# EAGLE schematic untitled (EAGLE 6.4)

## Sheet 1 of 5: main
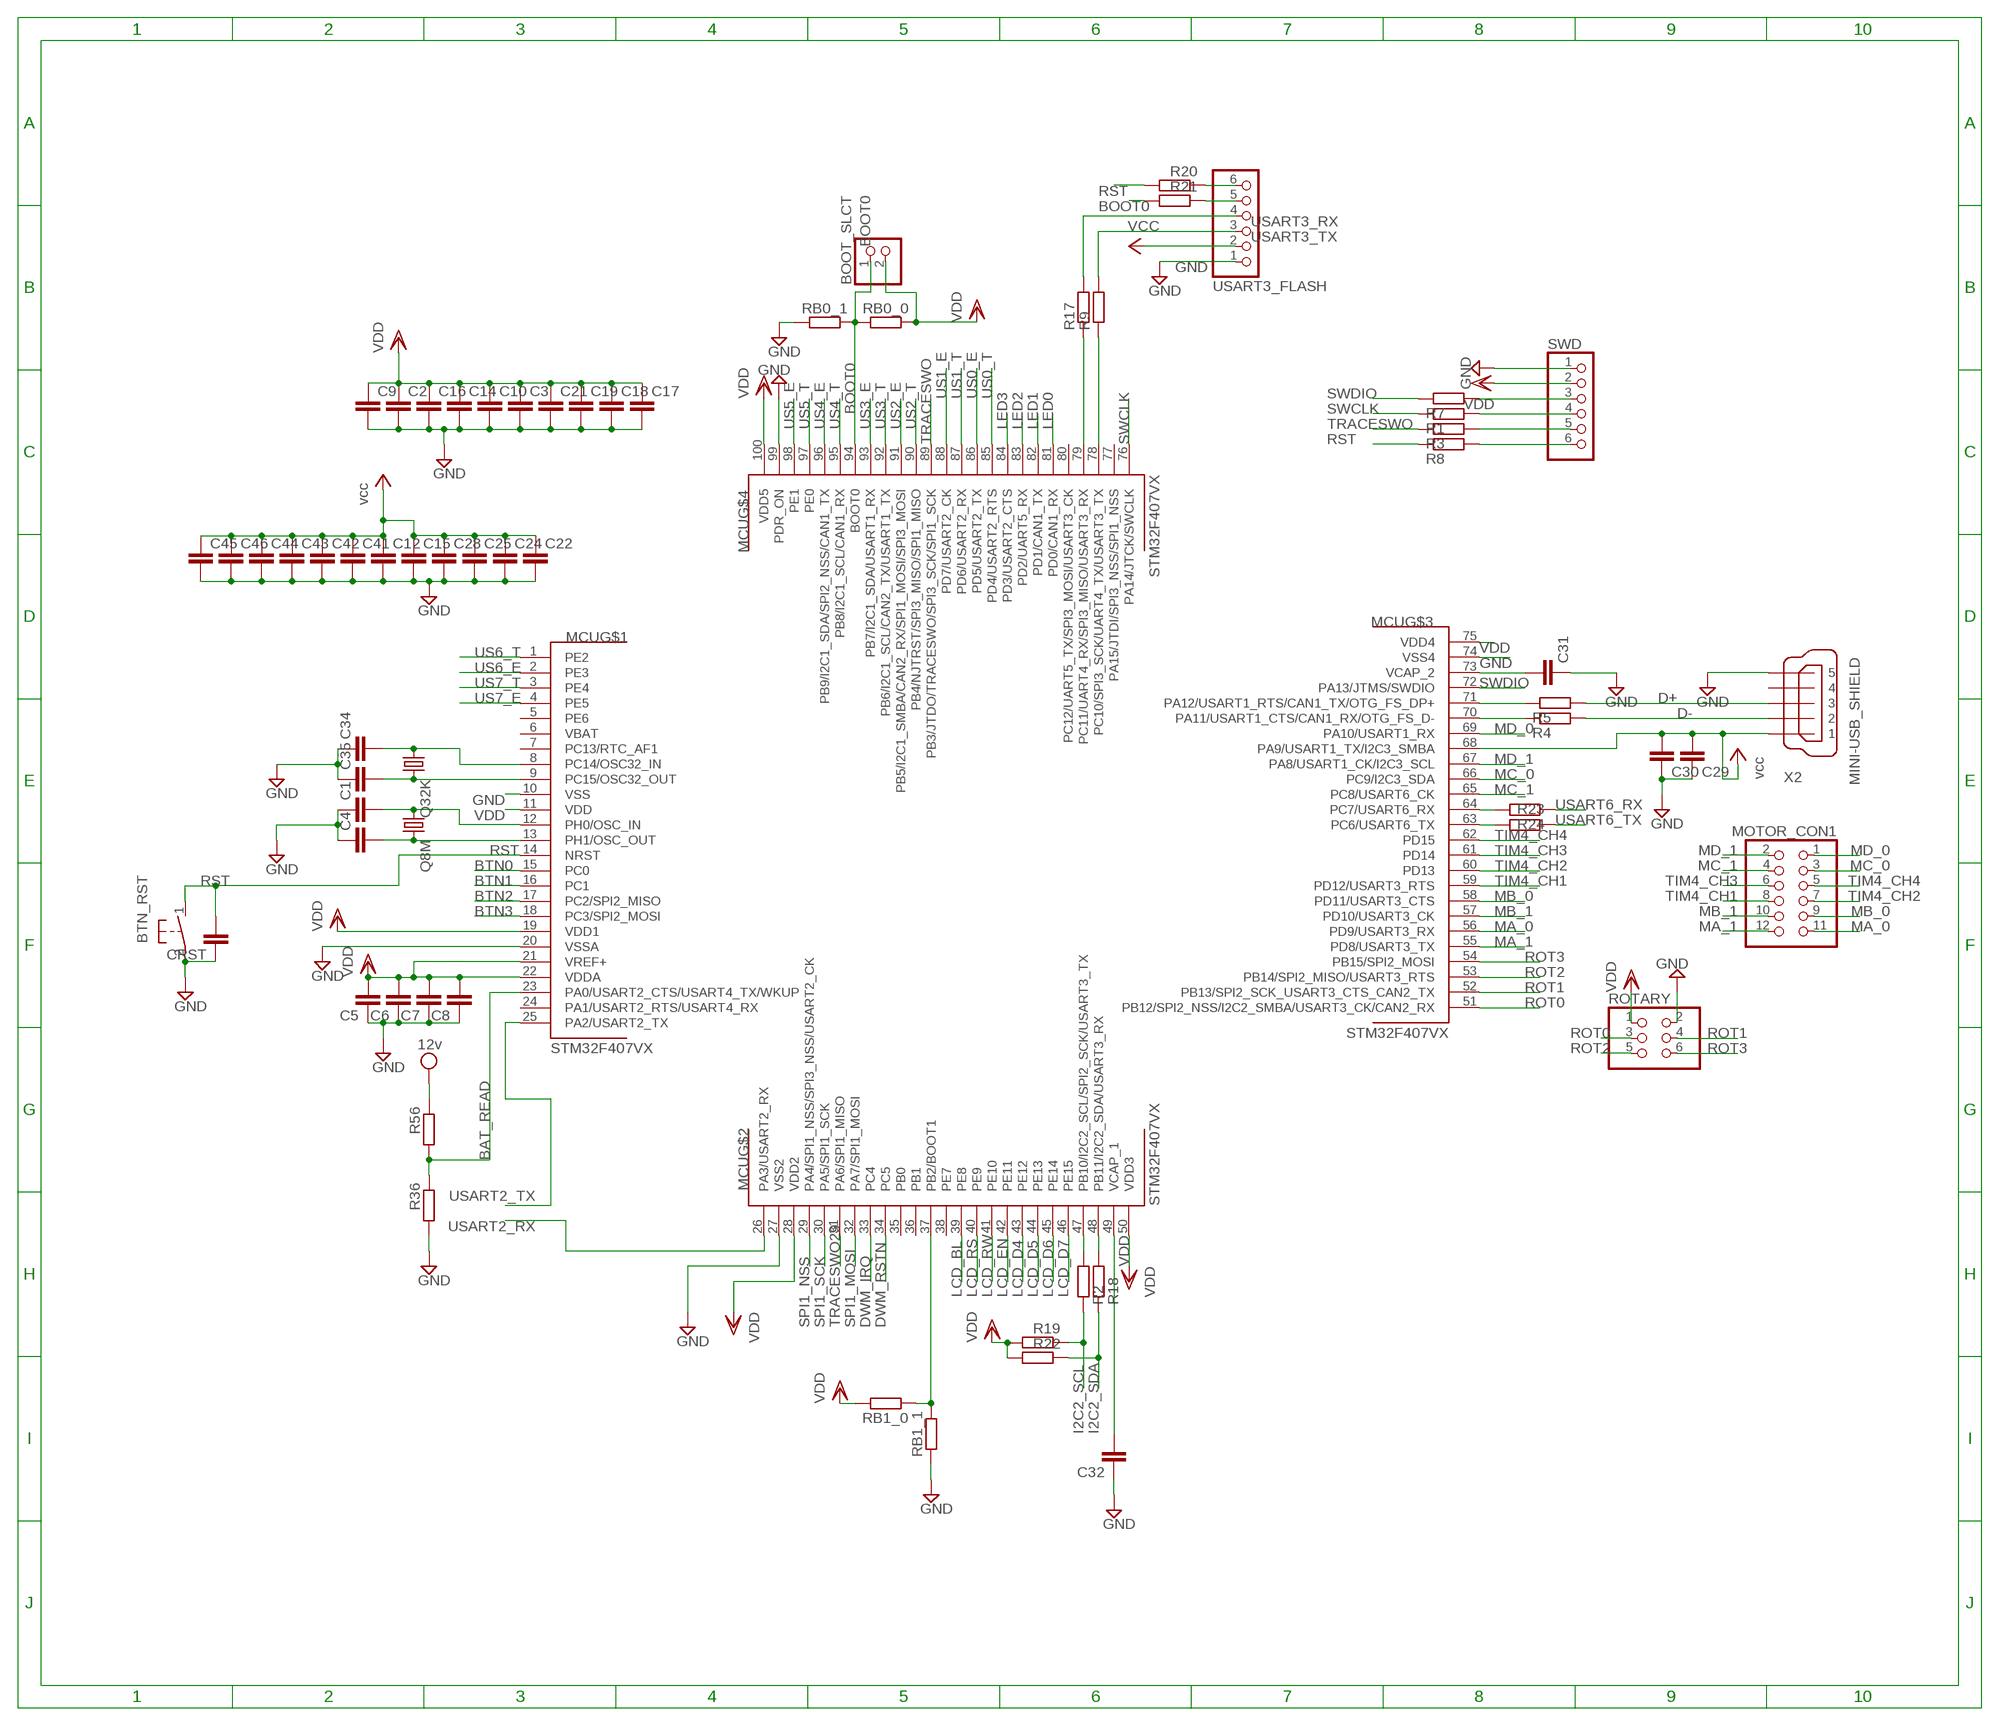
[diagram p0: schematic, sheet 1]

### Parts
BOOT_SLCT  PINHD-1X2  [1X02]
BTN_RST  PUSHBTN  [PUSHBUTTON]
C1  C-EUC0805  [C0805]
C2  C-EUC0805  [C0805]
C3  C-EUC0805  [C0805]
C4  C-EUC0805  [C0805]
C5  C-EUC0805  [C0805]
C6  C-EUC0805  [C0805]
C7  C-EUC0805  [C0805]
C8  C-EUC0805  [C0805]
C9  C-EUC0805  [C0805]
C10  C-EUC0805  [C0805]
C12  C-EUC0805  [C0805]
C14  C-EUC0805  [C0805]
C15  C-EUC0805  [C0805]
C16  C-EUC0805  [C0805]
C17  C-EUC0805  [C0805]
C18  C-EUC0805  [C0805]
C19  C-EUC0805  [C0805]
C21  C-EUC0805  [C0805]
C22  C-EUC0805  [C0805]
C24  C-EUC0805  [C0805]
C25  C-EUC0805  [C0805]
C28  C-EUC0805  [C0805]
C29  C-EUC0805  [C0805]
C30  C-EUC0805  [C0805]
C31  C-EUC0805  [C0805]
C32  C-EUC0805  [C0805]
C34  C-EUC0805  [C0805]
C35  C-EUC0805  [C0805]
C41  C-EUC0805  [C0805]
C42  C-EUC0805  [C0805]
C43  C-EUC0805  [C0805]
C44  C-EUC0805  [C0805]
C45  C-EUC0805  [C0805]
C46  C-EUC0805  [C0805]
CRST  C-EUC0805  [C0805]
MCU  STM32F407VX  [LQFP100]
MOTOR_CON1  PINHD-2X6  [2X06]
Q8M  CRYSTALHC49U-V  [HC49U-V]
Q32K  CRYSTALTC26V  [TC26V]
R1  R-EU_M0805  [M0805]
R2  R-EU_M0805  [M0805]
R3  R-EU_M0805  [M0805]
R4  R-EU_M0805  [M0805]
R5  R-EU_M0805  [M0805]
R7  R-EU_M0805  [M0805]
R8  R-EU_M0805  [M0805]
R9  R-EU_M0805  [M0805]
R17  R-EU_M0805  [M0805]
R18  R-EU_M0805  [M0805]
R19  R-EU_M0805  [M0805]
R20  R-EU_R0805  [R0805]
R21  R-EU_R0805  [R0805]
R22  R-EU_M0805  [M0805]
R23  R-EU_M0805  [M0805]
R24  R-EU_M0805  [M0805]
R36  R-EU_M0805  [M0805]
R56  R-EU_M0805  [M0805]
RB0_0  R-EU_M0805  [M0805]
RB0_1  R-EU_M0805  [M0805]
RB1_0  R-EU_M0805  [M0805]
RB1_1  R-EU_M0805  [M0805]
ROTARY  PINHD-2X3  [2X03]
SWD  PINHD-1X06_2.54-S  [1X06-S]
USART3_FLASH  PINHD-1X6  [1X06]
X2  MINI-USB_SHIELD  MINI-USB_SHIELD5P4-32005-400  [32005-400]

### Nets
12V: R56.1 ; supply symbol labelled 12v ; also sheet 3
BAT_READ: MCU.23(PA0/USART2_CTS/USART4_TX/WKUP) R36.1 R56.2
BOOT0: BOOT_SLCT.1 MCU.94(BOOT0) R21.2 RB0_0.1 RB0_1.2
BOOT1: MCU.37(PB2/BOOT1) RB1_0.1 RB1_1.2
BTN0: MCU.15(PC0) ; also sheet 2
BTN1: MCU.16(PC1) ; also sheet 2
BTN2: MCU.17(PC2/SPI2_MISO) ; also sheet 2
BTN3: MCU.18(PC3/SPI2_MOSI) ; also sheet 2
D+: R5.2 X2.3
D-: R4.2 X2.2
DWM_IRQ: MCU.33(PC4) ; also sheet 5
DWM_RSTN: MCU.34(PC5) ; also sheet 5
GND: BTN_RST.2 C1.1 C2.2 C3.2 C4.1 C5.1 C6.1 C7.1 C8.1 C9.2 C10.2 C12.2 C14.2 C15.2 C16.2 C17.2 C18.2 C19.2 C21.2 C22.2 C24.2 C25.2 C28.2 C29.1 C30.1 C31.1 C32.1 C34.1 C35.1 C41.2 C42.2 C43.2 C44.2 C45.2 C46.2 CRST.1 MCU.10(VSS) MCU.20(VSSA) MCU.27(VSS2) MCU.74(VSS4) MCU.99(PDR_ON) R36.2 RB0_1.1 RB1_1.1 ROTARY.2 SWD.1 USART3_FLASH.1 X2.5 ; also sheet 2,3,5
I2C2_SCL: R2.1 R19.1 ; also sheet 5
I2C2_SDA: R18.1 R22.1 ; also sheet 5
LCD_BL: MCU.39(PE8) ; also sheet 2
LCD_D4: MCU.43(PE12) ; also sheet 2
LCD_D5: MCU.44(PE13) ; also sheet 2
LCD_D6: MCU.45(PE14) ; also sheet 2
LCD_D7: MCU.46(PE15) ; also sheet 2
LCD_EN: MCU.42(PE11) ; also sheet 2
LCD_RS: MCU.40(PE9) ; also sheet 2
LCD_RW: MCU.41(PE10) ; also sheet 2
LED0: MCU.81(PD0/CAN1_RX) ; also sheet 2
LED1: MCU.82(PD1/CAN1_TX) ; also sheet 2
LED2: MCU.83(PD2/UART5_RX) ; also sheet 2
LED3: MCU.84(PD3/USART2_CTS) ; also sheet 2
MA_0: MCU.56(PD9/USART3_RX) MOTOR_CON1.11
MA_1: MCU.55(PD8/USART3_TX) MOTOR_CON1.12
MB_0: MCU.58(PD11/USART3_CTS) MOTOR_CON1.9
MB_1: MCU.57(PD10/USART3_CK) MOTOR_CON1.10
MC_0: MCU.66(PC9/I2C3_SDA) MOTOR_CON1.3
MC_1: MCU.65(PC8/USART6_CK) MOTOR_CON1.4
MD_0: MCU.69(PA10/USART1_RX) MOTOR_CON1.1
MD_1: MCU.67(PA8/USART1_CK/I2C3_SCL) MOTOR_CON1.2
N$1: MCU.64(PC7/USART6_RX) R23.1
N$2: R3.2 SWD.5
N$4: C31.2 MCU.73(VCAP_2)
N$14: MCU.63(PC6/USART6_TX) R24.1
N$16: R8.2 SWD.6
N$18: R7.2 SWD.3
N$21: R1.2 SWD.4
N$22: MCU.47(PB10/I2C2_SCL/SPI2_SCK/USART3_TX) R2.2
N$23: C32.2 MCU.49(VCAP_1)
N$24: MCU.48(PB11/I2C2_SDA/USART3_RX) R18.2
N$25: R20.1 USART3_FLASH.6
N$26: MCU.78(PC10/SPI3_SCK/UART4_TX/USART3_TX) R9.1
N$27: MCU.79(PC11/UART4_RX/SPI3_MISO/USART3_RX) R17.1
N$72: R21.1 USART3_FLASH.5
N$310: MCU.71(PA12/USART1_RTS/CAN1_TX/OTG_FS_DP+) R5.1
N$312: MCU.70(PA11/USART1_CTS/CAN1_RX/OTG_FS_D-) R4.1
OSC32_IN1: C34.2 MCU.8(PC14/OSC32_IN) Q32K.1
OSC32_OUT1: C35.2 MCU.9(PC15/OSC32_OUT) Q32K.2
OSC_IN: C1.2 MCU.12(PH0/OSC_IN) Q8M.1
OSC_OUT: C4.2 MCU.13(PH1/OSC_OUT) Q8M.2
ROT0: MCU.51(PB12/SPI2_NSS/I2C2_SMBA/USART3_CK/CAN2_RX) ROTARY.3
ROT1: MCU.52(PB13/SPI2_SCK_USART3_CTS_CAN2_TX) ROTARY.4
ROT2: MCU.53(PB14/SPI2_MISO/USART3_RTS) ROTARY.5
ROT3: MCU.54(PB15/SPI2_MOSI) ROTARY.6
RST: BTN_RST.1 CRST.2 MCU.14(NRST) R8.1 R20.2
SPI1_MOSI: MCU.32(PA7/SPI1_MOSI) ; also sheet 5
SPI1_NSS: MCU.29(PA4/SPI1_NSS/SPI3_NSS/USART2_CK) ; also sheet 5
SPI1_SCK: MCU.30(PA5/SPI1_SCK) ; also sheet 5
SWCLK: MCU.76(PA14/JTCK/SWCLK) R1.1
SWDIO: MCU.72(PA13/JTMS/SWDIO) R7.1
TIM4_CH1: MCU.59(PD12/USART3_RTS) MOTOR_CON1.8
TIM4_CH2: MCU.60(PD13) MOTOR_CON1.7
TIM4_CH3: MCU.61(PD14) MOTOR_CON1.6
TIM4_CH4: MCU.62(PD15) MOTOR_CON1.5
TRACESWO: MCU.89(PB3/JTDO/TRACESWO/SPI3_SCK/SPI1_SCK) R3.1
TRACESWO29: MCU.31(PA6/SPI1_MISO) ; also sheet 5
US0_E: MCU.86(PD5/USART2_TX) ; also sheet 5
US0_T: MCU.85(PD4/USART2_RTS) ; also sheet 5
US1_E: MCU.88(PD7/USART2_CK) ; also sheet 5
US1_T: MCU.87(PD6/USART2_RX) ; also sheet 5
US2_E: MCU.91(PB5/I2C1_SMBA/CAN2_RX/SPI1_MOSI/SPI3_MOSI) ; also sheet 5
US2_T: MCU.90(PB4/NJTRST/SPI3_MISO/SPI1_MISO) ; also sheet 5
US3_E: MCU.93(PB7/I2C1_SDA/USART1_RX) ; also sheet 5
US3_T: MCU.92(PB6/I2C1_SCL/CAN2_TX/USART1_TX) ; also sheet 5
US4_E: MCU.96(PB9/I2C1_SDA/SPI2_NSS/CAN1_TX) ; also sheet 5
US4_T: MCU.95(PB8/I2C1_SCL/CAN1_RX) ; also sheet 5
US5_E: MCU.98(PE1) ; also sheet 5
US5_T: MCU.97(PE0) ; also sheet 5
US6_E: MCU.2(PE3) ; also sheet 5
US6_T: MCU.1(PE2) ; also sheet 5
US7_E: MCU.4(PE5) ; also sheet 5
US7_T: MCU.3(PE4) ; also sheet 5
USART2_RX: MCU.26(PA3/USART2_RX) ; also sheet 5
USART2_TX: MCU.25(PA2/USART2_TX) ; also sheet 5
USART3_RX: R17.2 USART3_FLASH.4 ; also sheet 5
USART3_TX: R9.2 USART3_FLASH.3 ; also sheet 5
USART6_RX: R23.2 ; also sheet 5
USART6_TX: R24.2 ; also sheet 5
VCC: C12.1 C15.1 C22.1 C24.1 C25.1 C28.1 C29.2 C30.2 C41.1 C42.1 C43.1 C44.1 C45.1 C46.1 MCU.68(PA9/USART1_TX/I2C3_SMBA) USART3_FLASH.2 X2.1 ; supply symbol labelled vcc ; also sheet 2,3,5
VDD: BOOT_SLCT.2 C2.1 C3.1 C5.2 C6.2 C7.2 C8.2 C9.1 C10.1 C14.1 C16.1 C17.1 C18.1 C19.1 C21.1 MCU.11(VDD) MCU.19(VDD1) MCU.21(VREF+) MCU.22(VDDA) MCU.28(VDD2) MCU.50(VDD3) MCU.75(VDD4) MCU.100(VDD5) R19.2 R22.2 RB0_0.2 RB1_0.2 ROTARY.1 SWD.2 ; also sheet 2,3,5
Unconnected: MCU.5(PE6) MCU.6(VBAT) MCU.7(PC13/RTC_AF1) MCU.24(PA1/USART2_RTS/USART4_RX) MCU.35(PB0) MCU.36(PB1) MCU.38(PE7) MCU.77(PA15/JTDI/SPI3_NSS/SPI1_NSS) MCU.80(PC12/UART5_TX/SPI3_MOSI/USART3_CK) X2.4 X2.M1(S1) X2.M2(S2) X2.M3(S3) X2.M4(S4)

## Sheet 2 of 5: led,lcd,btn
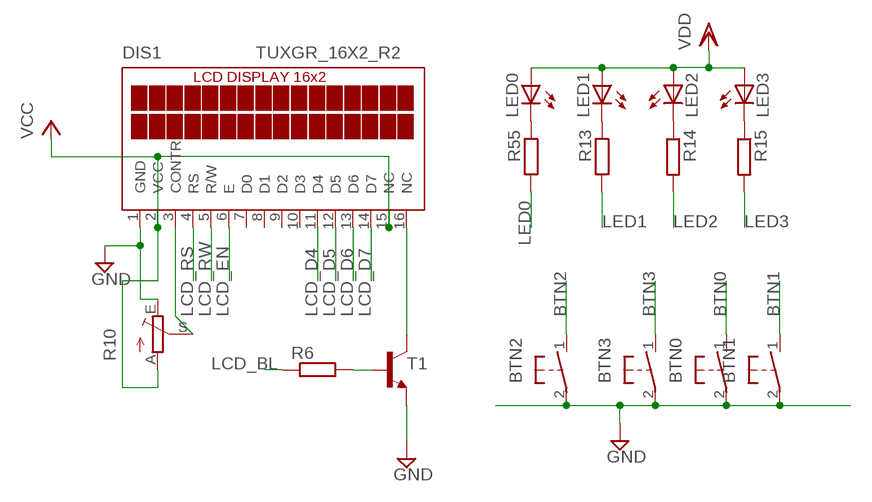
[diagram p1: schematic, sheet 2]

### Parts
BTN0  PUSHBTN  [PUSHBUTTON]
BTN1  PUSHBTN  [PUSHBUTTON]
BTN2  PUSHBTN  [PUSHBUTTON]
BTN3  PUSHBTN  [PUSHBUTTON]
DIS1  TUXGR_16X2_R2  [TUXGR_16X2_R2]
LED0  LEDSMT1206  [1206]
LED1  LEDSMT1206  [1206]
LED2  LEDSMT1206  [1206]
LED3  LEDSMT1206  [1206]
R6  R-EU_M0805  [M0805]
R10  TRIM_EU-CA6V  [CA6V]
R13  R-EU_M0805  [M0805]
R14  R-EU_M0805  [M0805]
R15  R-EU_M0805  [M0805]
R55  R-EU_M0805  [M0805]
T1  BC818-NPN-SOT23-BEC  [SOT23-BEC]

### Nets
BTN0: BTN0.1 ; also sheet 1
BTN1: BTN1.1 ; also sheet 1
BTN2: BTN2.1 ; also sheet 1
BTN3: BTN3.1 ; also sheet 1
GND: BTN0.2 BTN1.2 BTN2.2 BTN3.2 DIS1.1(GND) R10.E T1.E ; also sheet 1,3,5
LCD_BL: R6.1 ; also sheet 1
LCD_D4: DIS1.11(D4) ; also sheet 1
LCD_D5: DIS1.12(D5) ; also sheet 1
LCD_D6: DIS1.13(D6) ; also sheet 1
LCD_D7: DIS1.14(D7) ; also sheet 1
LCD_EN: DIS1.6(E) ; also sheet 1
LCD_RS: DIS1.4(RS) ; also sheet 1
LCD_RW: DIS1.5(R/W) ; also sheet 1
LED0: R55.2 ; also sheet 1
LED1: R13.2 ; also sheet 1
LED2: R14.2 ; also sheet 1
LED3: R15.2 ; also sheet 1
N$8: DIS1.3(CONTR) R10.S
N$9: LED1.C R13.1
N$10: LED2.C R14.1
N$11: LED3.C R15.1
N$13: R6.2 T1.B
N$15: DIS1.16(NC) T1.C
N$82: LED0.C R55.1
VCC: DIS1.2(VCC) DIS1.15(NC) R10.A ; also sheet 1,3,5
VDD: LED0.A LED1.A LED2.A LED3.A ; also sheet 1,3,5
Unconnected: DIS1.7(D0) DIS1.8(D1) DIS1.9(D2) DIS1.10(D3)

## Sheet 3 of 5: power
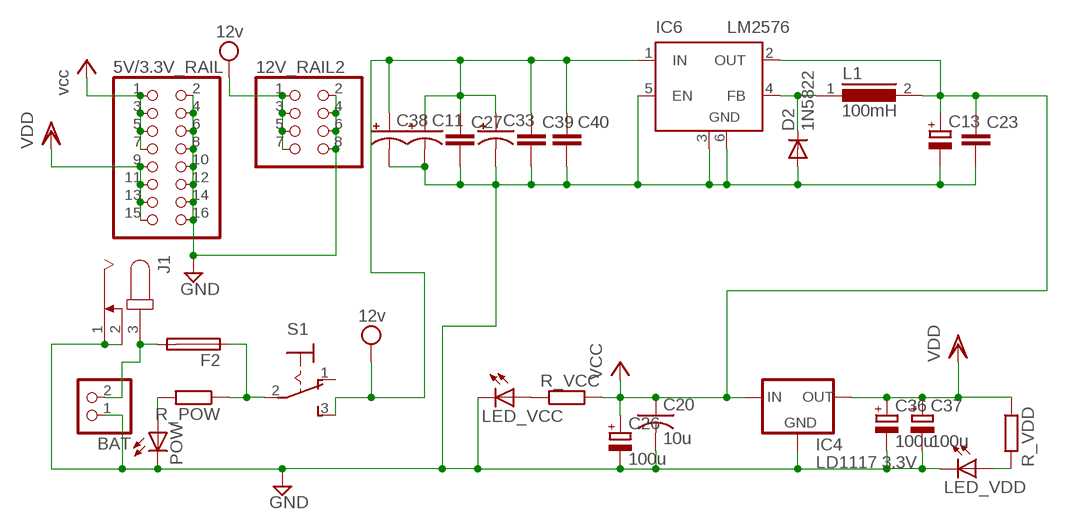
[diagram p2: schematic, sheet 3]

### Parts
5V/3.3V_RAIL  PINHD-2X8  [2X08]
12V_RAIL2  PINHD-2X4  [2X04]
BAT  PINHD-1X2  [1X02]
C11  CAP_POLH13  [PANASONIC_H13]
C13  CPOL-EU153CLV-1012  [153CLV-1012]
C20  10u  C-USC0805  [C0805]
C23  C-EUC0805  [C0805]
C26  100u  CPOL-EU153CLV-1012  [153CLV-1012]
C27  C-EUC0805  [C0805]
C33  CAP_POLH13  [PANASONIC_H13]
C36  100u  CPOL-EU153CLV-1012  [153CLV-1012]
C37  100u  CPOL-EU153CLV-1012  [153CLV-1012]
C38  CAP_POLH13  [PANASONIC_H13]
C39  C-EUC0805  [C0805]
C40  C-EUC0805  [C0805]
D2  1N5822  1N5060GP  [DO15-12]
F2  FUSESHK20L  [SHK20L]
IC4  LD1117 3.3V  LM1117  [SOT223]
IC6  LM2576  LM2596S  [TO263-5]
J1  JACK-PLUG1  [SPC4078]
L1  100mH  DR127  [DR127]
LED_VCC  LEDSMT1206  [1206]
LED_VDD  LEDSMT1206  [1206]
POW  LEDSMT1206  [1206]
R_POW  R-EU_M0805  [M0805]
R_VCC  R-EU_M0805  [M0805]
R_VDD  R-EU_M0805  [M0805]
S1  320-916  [320-916]

### Nets
12V: 12V_RAIL2.1 12V_RAIL2.3 12V_RAIL2.5 12V_RAIL2.7 C11.+ C27.1 C33.+ C38.+ C39.1 C40.1 IC6.1(IN) S1.3(S) ; supply symbol labelled 12v ; also sheet 1
GND: 5V/3.3V_RAIL.2 5V/3.3V_RAIL.4 5V/3.3V_RAIL.6 5V/3.3V_RAIL.8 5V/3.3V_RAIL.10 5V/3.3V_RAIL.12 5V/3.3V_RAIL.14 5V/3.3V_RAIL.16 12V_RAIL2.2 12V_RAIL2.4 12V_RAIL2.6 12V_RAIL2.8 BAT.1 C11.- C13.- C20.2 C23.2 C26.- C27.2 C33.- C36.- C37.- C38.- C39.2 C40.2 D2.A IC4.1(GND) IC6.3(GND) IC6.5(EN) IC6.6(GND) J1.1 J1.2 LED_VCC.C LED_VDD.C POW.C ; also sheet 1,2,5
N$3: BAT.2 F2.2A J1.3
N$6: LED_VDD.A R_VDD.2
N$17: D2.C IC6.4(FB) L1.1
N$20: POW.A R_POW.2
N$29: LED_VCC.A R_VCC.1
N$93: F2.1A R_POW.1 S1.2(P)
VCC: 5V/3.3V_RAIL.1 5V/3.3V_RAIL.3 5V/3.3V_RAIL.5 5V/3.3V_RAIL.7 C13.+ C20.1 C23.1 C26.+ IC4.3(IN) IC6.2(OUT) L1.2 R_VCC.2 ; supply symbol labelled vcc ; also sheet 1,2,5
VDD: 5V/3.3V_RAIL.9 5V/3.3V_RAIL.11 5V/3.3V_RAIL.13 5V/3.3V_RAIL.15 C36.+ C37.+ IC4.2(OUT) R_VDD.1 ; also sheet 1,2,5
Unconnected: S1.1(O)

## Sheet 4 of 5: DRIVER
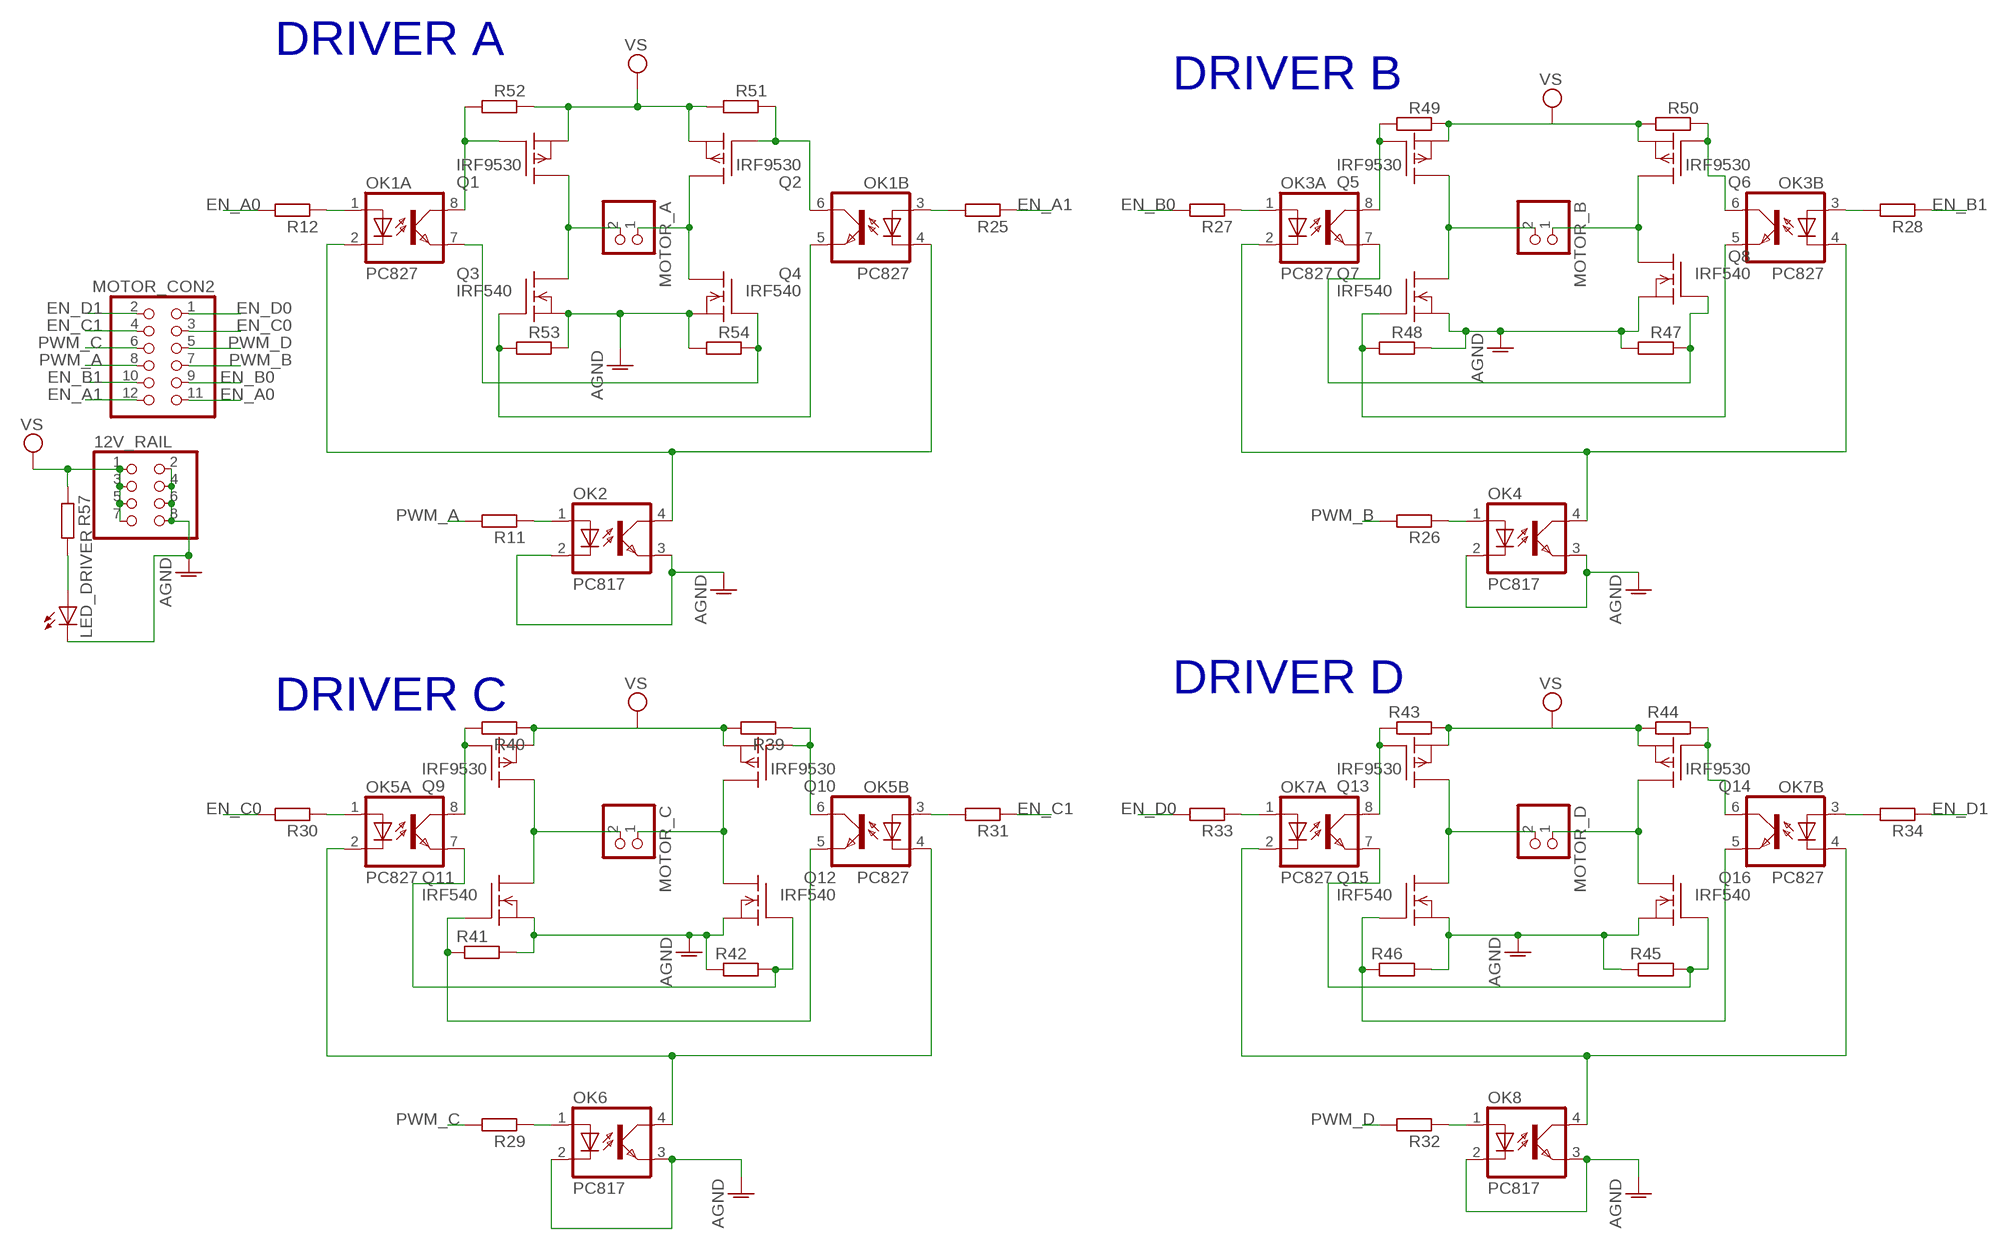
[diagram p3: schematic, sheet 4]

### Parts
12V_RAIL  PINHD-2X4  [2X04]
LED_DRIVER  LEDSMT1206  [1206]
MOTOR_A  PINHD-1X2/90  [1X02/90]
MOTOR_B  PINHD-1X2/90  [1X02/90]
MOTOR_C  PINHD-1X2/90  [1X02/90]
MOTOR_CON2  PINHD-2X6  [2X06]
MOTOR_D  PINHD-1X2/90  [1X02/90]
OK1  PC827  [DIL08]
OK2  PC817  [DIL04]
OK3  PC827  [DIL08]
OK4  PC817  [DIL04]
OK5  PC827  [DIL08]
OK6  PC817  [DIL04]
OK7  PC827  [DIL08]
OK8  PC817  [DIL04]
Q1  IRF9530  [TO220]
Q2  IRF9530  [TO220]
Q3  IRF540  [TO220]
Q4  IRF540  [TO220]
Q5  IRF9530  [TO220]
Q6  IRF9530  [TO220]
Q7  IRF540  [TO220]
Q8  IRF540  [TO220]
Q9  IRF9530  [TO220]
Q10  IRF9530  [TO220]
Q11  IRF540  [TO220]
Q12  IRF540  [TO220]
Q13  IRF9530  [TO220]
Q14  IRF9530  [TO220]
Q15  IRF540  [TO220]
Q16  IRF540  [TO220]
R11  R-EU_M0805  [M0805]
R12  R-EU_M0805  [M0805]
R25  R-EU_M0805  [M0805]
R26  R-EU_M0805  [M0805]
R27  R-EU_M0805  [M0805]
R28  R-EU_M0805  [M0805]
R29  R-EU_M0805  [M0805]
R30  R-EU_M0805  [M0805]
R31  R-EU_M0805  [M0805]
R32  R-EU_M0805  [M0805]
R33  R-EU_M0805  [M0805]
R34  R-EU_M0805  [M0805]
R39  R-EU_M0805  [M0805]
R40  R-EU_M0805  [M0805]
R41  R-EU_M0805  [M0805]
R42  R-EU_M0805  [M0805]
R43  R-EU_M0805  [M0805]
R44  R-EU_M0805  [M0805]
R45  R-EU_M0805  [M0805]
R46  R-EU_M0805  [M0805]
R47  R-EU_M0805  [M0805]
R48  R-EU_M0805  [M0805]
R49  R-EU_M0805  [M0805]
R50  R-EU_M0805  [M0805]
R51  R-EU_M0805  [M0805]
R52  R-EU_M0805  [M0805]
R53  R-EU_M0805  [M0805]
R54  R-EU_M0805  [M0805]
R57  R-EU_M0805  [M0805]

### Nets
AGND: 12V_RAIL.2 12V_RAIL.4 12V_RAIL.6 12V_RAIL.8 LED_DRIVER.C OK2.2(C) OK2.3(EMIT) OK4.2(C) OK4.3(EMIT) OK6.2(C) OK6.3(EMIT) OK8.2(C) OK8.3(EMIT) Q3.3(S) Q4.3(S) Q7.3(S) Q8.3(S) Q11.3(S) Q12.3(S) Q15.3(S) Q16.3(S) R41.2 R42.1 R45.1 R46.2 R47.2 R48.1 R53.1 R54.2
EN_A0: MOTOR_CON2.11 R12.2
EN_A1: MOTOR_CON2.12 R25.1
EN_B0: MOTOR_CON2.9 R27.2
EN_B1: MOTOR_CON2.10 R28.1
EN_C0: MOTOR_CON2.3 R30.2
EN_C1: MOTOR_CON2.4 R31.1
EN_D0: MOTOR_CON2.1 R33.2
EN_D1: MOTOR_CON2.2 R34.1
N$12: OK3.7(A:EMIT) Q8.1(G) R47.1
N$30: MOTOR_A.2 Q1.2(D) Q3.2(D)
N$33: MOTOR_A.1 Q2.2(D) Q4.2(D)
N$34: OK1.8(A:COL) Q1.1(G) R52.2
N$35: OK1.7(A:EMIT) Q4.1(G) R54.1
N$36: OK1.6(B:COL) Q2.1(G) R51.1
N$37: OK1.5(B:EMIT) Q3.1(G) R53.2
N$38: OK1.2(A:C) OK1.4(B:C) OK2.4(COL)
N$39: MOTOR_B.2 Q5.2(D) Q7.2(D)
N$40: MOTOR_B.1 Q6.2(D) Q8.2(D)
N$41: OK1.1(A:A) R12.1
N$42: OK1.3(B:A) R25.2
N$43: OK3.8(A:COL) Q5.1(G) R49.2
N$44: OK2.1(A) R11.1
N$46: OK3.6(B:COL) Q6.1(G) R50.1
N$47: OK3.5(B:EMIT) Q7.1(G) R48.2
N$48: OK3.2(A:C) OK3.4(B:C) OK4.4(COL)
N$49: OK3.1(A:A) R27.1
N$50: OK3.3(B:A) R28.2
N$51: OK4.1(A) R26.1
N$52: MOTOR_C.2 Q9.2(D) Q11.2(D)
N$53: MOTOR_C.1 Q10.2(D) Q12.2(D)
N$54: OK5.8(A:COL) Q9.1(G) R40.2
N$55: OK5.7(A:EMIT) Q12.1(G) R42.2
N$56: OK5.6(B:COL) Q10.1(G) R39.1
N$57: OK5.5(B:EMIT) Q11.1(G) R41.1
N$58: OK5.2(A:C) OK5.4(B:C) OK6.4(COL)
N$59: OK5.1(A:A) R30.1
N$60: OK5.3(B:A) R31.2
N$61: OK6.1(A) R29.1
N$62: MOTOR_D.2 Q13.2(D) Q15.2(D)
N$63: MOTOR_D.1 Q14.2(D) Q16.2(D)
N$64: OK7.8(A:COL) Q13.1(G) R43.1
N$65: OK7.7(A:EMIT) Q16.1(G) R45.2
N$66: OK7.6(B:COL) Q14.1(G) R44.2
N$67: OK7.5(B:EMIT) Q15.1(G) R46.1
N$68: OK7.2(A:C) OK7.4(B:C) OK8.4(COL)
N$69: OK7.1(A:A) R33.1
N$70: OK7.3(B:A) R34.2
N$71: OK8.1(A) R32.1
N$341: LED_DRIVER.A R57.2
PWM_A: MOTOR_CON2.8 R11.2
PWM_B: MOTOR_CON2.7 R26.2
PWM_C: MOTOR_CON2.6 R29.2
PWM_D: MOTOR_CON2.5 R32.2
VS+: 12V_RAIL.1 12V_RAIL.3 12V_RAIL.5 12V_RAIL.7 Q1.3(S) Q2.3(S) Q5.3(S) Q6.3(S) Q9.3(S) Q10.3(S) Q13.3(S) Q14.3(S) R39.2 R40.1 R43.2 R44.1 R49.1 R50.2 R51.2 R52.1 R57.1 ; supply symbol labelled VS

### Notes on the sheet
- DRIVER A
- DRIVER B
- DRIVER D
- DRIVER C

## Sheet 5 of 5: peripheral
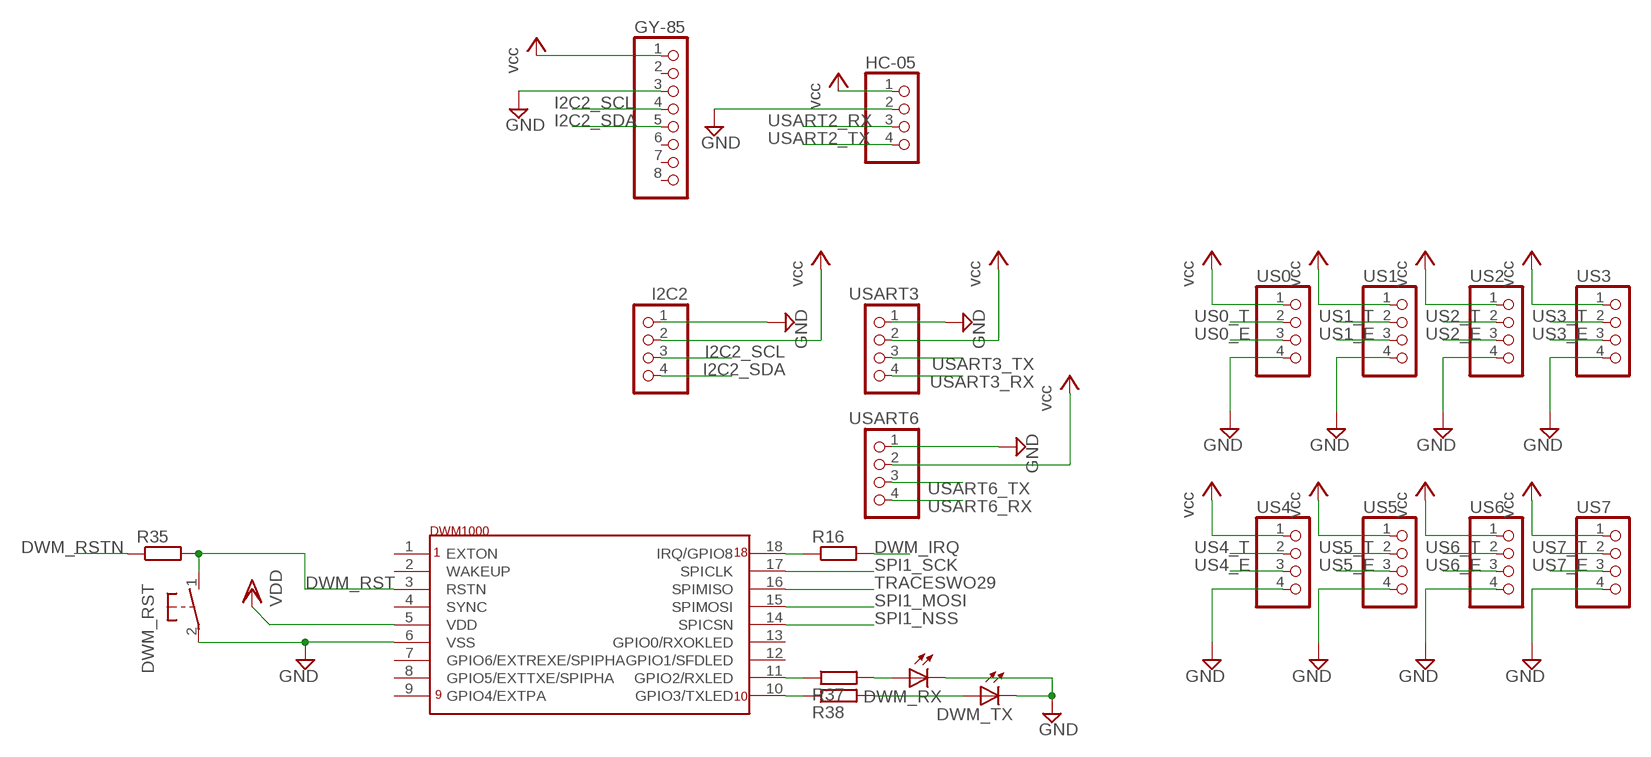
[diagram p4: schematic, sheet 5]

### Parts
DWM_RST  PUSHBTN  [PUSHBUTTON]
DWM_RX  LEDSMT1206  [1206]
DWM_TX  LEDSMT1206  [1206]
GY-85  PINHD-1X8  [1X08]
HC-05  PINHD-1X4  [1X04]
I2C2  PINHD-1X4  [1X04]
R16  R-EU_M0805  [M0805]
R35  R-EU_M0805  [M0805]
R37  R-EU_M0805  [M0805]
R38  R-EU_M0805  [M0805]
U$3  MY_DWM1000_PAD_ONLY  [MY_DWM1000_PAD_ONLY]
US0  PINHD-1X4  [1X04]
US1  PINHD-1X4  [1X04]
US2  PINHD-1X4  [1X04]
US3  PINHD-1X4  [1X04]
US4  PINHD-1X4  [1X04]
US5  PINHD-1X4  [1X04]
US6  PINHD-1X4  [1X04]
US7  PINHD-1X4  [1X04]
USART3  PINHD-1X4  [1X04]
USART6  PINHD-1X4  [1X04]

### Nets
DWM_IRQ: R16.2 ; also sheet 1
DWM_RST: DWM_RST.1 R35.2 U$3.3(RSTN)
DWM_RSTN: R35.1 ; also sheet 1
GND: DWM_RST.2 DWM_RX.C DWM_TX.C GY-85.3 HC-05.2 I2C2.1 U$3.6(VSS) US0.4 US1.4 US2.4 US3.4 US4.4 US5.4 US6.4 US7.4 USART3.1 USART6.1 ; also sheet 1,2,3
I2C2_SCL: GY-85.4 I2C2.3 ; also sheet 1
I2C2_SDA: GY-85.5 I2C2.4 ; also sheet 1
N$83: R37.1 U$3.11(GPIO2/RXLED)
N$84: R38.1 U$3.10(GPIO3/TXLED)
N$85: DWM_RX.A R37.2
N$86: DWM_TX.A R38.2
N$91: R16.1 U$3.18(IRQ/GPIO8)
SPI1_MOSI: U$3.15(SPIMOSI) ; also sheet 1
SPI1_NSS: U$3.14(SPICSN) ; also sheet 1
SPI1_SCK: U$3.17(SPICLK) ; also sheet 1
TRACESWO29: U$3.16(SPIMISO) ; also sheet 1
US0_E: US0.3 ; also sheet 1
US0_T: US0.2 ; also sheet 1
US1_E: US1.3 ; also sheet 1
US1_T: US1.2 ; also sheet 1
US2_E: US2.3 ; also sheet 1
US2_T: US2.2 ; also sheet 1
US3_E: US3.3 ; also sheet 1
US3_T: US3.2 ; also sheet 1
US4_E: US4.3 ; also sheet 1
US4_T: US4.2 ; also sheet 1
US5_E: US5.3 ; also sheet 1
US5_T: US5.2 ; also sheet 1
US6_E: US6.3 ; also sheet 1
US6_T: US6.2 ; also sheet 1
US7_E: US7.3 ; also sheet 1
US7_T: US7.2 ; also sheet 1
USART2_RX: HC-05.3 ; also sheet 1
USART2_TX: HC-05.4 ; also sheet 1
USART3_RX: USART3.4 ; also sheet 1
USART3_TX: USART3.3 ; also sheet 1
USART6_RX: USART6.4 ; also sheet 1
USART6_TX: USART6.3 ; also sheet 1
VCC: GY-85.1 HC-05.1 I2C2.2 US0.1 US1.1 US2.1 US3.1 US4.1 US5.1 US6.1 US7.1 USART3.2 USART6.2 ; supply symbol labelled vcc ; also sheet 1,2,3
VDD: U$3.5(VDD) ; also sheet 1,2,3
Unconnected: GY-85.2 GY-85.6 GY-85.7 GY-85.8 U$3.1(EXTON) U$3.2(WAKEUP) U$3.4(SYNC) U$3.7(GPIO6/EXTREXE/SPIPHA) U$3.8(GPIO5/EXTTXE/SPIPHA) U$3.9(GPIO4/EXTPA) U$3.12(GPIO1/SFDLED) U$3.13(GPIO0/RXOKLED)

## Library data of the parts
5V/3.3V_RAIL = pinhead:PINHD-2X8: PIN HEADER
12V_RAIL 12V_RAIL2 = pinhead:PINHD-2X4: PIN HEADER
BAT BOOT_SLCT MOTOR_A MOTOR_B MOTOR_C MOTOR_D = pinhead:PINHD-1X2: PIN HEADER
BTN0 BTN1-BTN3 BTN_RST DWM_RST = switch-omron:PUSHBTN
C1-C10 C12 C14-C19 C21-C25 C27-C32 C34 C35 C39-C46 CRST = rcl:C-EU: CAPACITOR, European symbol
C11 C33 C38 = SparkFun-Passives:CAP_POL: Capacitor Polarized These are standard SMD and PTH capacitors. Normally 10uF, 47uF, and 100uF in electrolytic and tantalum varieties. Always verify the external diameter of the through hole cap, it varies with capacity, voltage, and manufacturer. The EIA devices should be standard.
C13 C26 C36 C37 = rcl:CPOL-EU: POLARIZED CAPACITOR, European symbol
C20 = rcl:C-US: CAPACITOR, American symbol
D2 = diode:1N5060GP: DIODE controlled avalanche rectifier
DIS1 = display-lcd:TUXGR_16X2_R2: Tuxgraphics LCD display 16x2 characters reflective, without background light Source: tuxgr_12x2_r2.pdf; OC_FARNELL: unknown; OC_NEWARK: unknown
DWM_RX DWM_TX LED0 LED1-LED3 LED_DRIVER LED_VCC LED_VDD POW = led:LED: LED OSRAM: - CHIPLED LG R971, LG N971, LY N971, LG Q971, LY Q971, LO R971, LY R971 LH N974, LH R974 LS Q976, LO Q976, LY Q976 LO Q996 - Hyper CHIPLED LW Q18S LB Q993, LB Q99A, LB R99A - SideLED LS A670, LO A670, LY A670, LG A670, LP A670 LB A673, LV A673, LT A673, LW A673 LH A674 LY A675 LS A676, LA A676, LO A676, LY A676, LW A676 LS A679, LY A679, LG A679 - Hyper Micro SIDELED® LS Y876, LA Y876, LO Y876, LY Y876 LT Y87S - SmartLED LW L88C, LW L88S LB L89C, LB L89S, LG L890 LS L89K, LO L89K, LY L89K LS L896, LA L896, LO L896, LY L896 - TOPLED LS T670, LO T670, LY T670, LG T670, LP T670 LSG T670, LSP T670, LSY T670, LOP T670, LYG T670 LG T671, LOG T671, LSG T671 LB T673, LV T673, LT T673, LW T673 LH T674 LS T676, LA T676, LO T676, LY T676, LB T676, LH T676, LSB T676, LW T676 LB T67C, LV T67C, LT T67C, LS T67K, LO T67K, LY T67K, LW E67C LS E67B, LA E67B, LO E67B, LY E67B, LB E67C, LV E67C, LT E67C LW T67C LS T679, LY T679, LG T679 LS T770, LO T770, LY T770, LG T770, LP T770 LB T773, LV T773, LT T773, LW T773 LH T774 LS E675, LA E675, LY E675, LS T675 LS T776, LA T776, LO T776, LY T776, LB T776 LHGB T686 LT T68C, LB T68C - Hyper Mini TOPLED® LB M676 - Mini TOPLED Santana® LG M470 LS M47K, LO M47K, LY M47K Source: http://www.osram.convergy.de LUXEON: - LUMILED® LXK2-PW12-R00, LXK2-PW12-S00, LXK2-PW14-U00, LXK2-PW14-V00 LXK2-PM12-R00, LXK2-PM12-S00, LXK2-PM14-U00 LXK2-PE12-Q00, LXK2-PE12-R00, LXK2-PE12-S00, LXK2-PE14-T00, LXK2-PE14-U00 LXK2-PB12-K00, LXK2-PB12-L00, LXK2-PB12-M00, LXK2-PB14-N00, LXK2-PB14-P00, LXK2-PB14-Q00 LXK2-PR12-L00, LXK2-PR12-M00, LXK2-PR14-Q00, LXK2-PR14-R00 LXK2-PD12-Q00, LXK2-PD12-R00, LXK2-PD12-S00 LXK2-PH12-R00, LXK2-PH12-S00 LXK2-PL12-P00, LXK2-PL12-Q00, LXK2-PL12-R00 Source: www.luxeon.com KINGBRIGHT: KA-3528ASYC Source: www.kingbright.com
F2 = fuse:FUSE: Fuse; OC_FARNELL: unknown; OC_NEWARK: unknown
GY-85 = pinhead:PINHD-1X8: PIN HEADER
HC-05 I2C2 US0 US1-US7 USART3 USART6 = pinhead:PINHD-1X4: PIN HEADER
IC4 = v-reg-3:LM1117
IC6 = linear:LM2596S: STEP-DOWN VOLTAGE REGULATOR
J1 = con-jack:JACK-PLUG: DC POWER JACK Power Jack, DC, Right Angle, Through Hole, Rated 5A at 16VDC, PC Terminals Distributor: Farnell (www.Farnell.de) Drawing: 84N1161.pdf / 84N1162.pdf Manufacturer: SPC Technology (www.spctechnology.com) Type: SPC4077 / SPC 4078; OC_FARNELL: unknown; OC_NEWARK: unknown
L1 = inductors:DR127: High Power Density, High Efficiency, Shielded Inductors Source: coiltronics_dr_series.pdf
MCU = STM32F407Vx_LQFP100:STM32F407VX: STmicroelectronics Cortex M4 Series Typ: STM32F407Vx LQFP100 Copyright 2012 by Ersan Günes, Quantitec, info@quantitec.de
MOTOR_CON1 MOTOR_CON2 = pinhead:PINHD-2X6: PIN HEADER
OK1 OK3 OK5 OK7 = optocoupler:PC827: SHARP OPTO COUPLER; OC_FARNELL: unknown; OC_NEWARK: unknown
OK2 OK4 OK6 OK8 = optocoupler:PC817: SHARP OPTO COUPLER; MPN: PC817X4J000F; OC_FARNELL: 9707727; OC_NEWARK: 97K7059
Q1 Q2 Q5 Q6 Q9 Q10 Q13 Q14 = transistor-fet:IRF9530: P-Channel Enhancement MOSFET (HEXFET); -100V; -12A; 0,3Ohm
Q3 Q4 Q7 Q8 Q11 Q12 Q15 Q16 = transistor-fet:IRF540: N-Channel Enhancement MOSFET (HEXFET); 100V; 28A; 0,077Ohm
Q8M = crystal:CRYSTAL: CRYSTAL; OC_FARNELL: 1666969; OC_NEWARK: unknown
Q32K = crystal:CRYSTAL: CRYSTAL; OC_FARNELL: unknown; OC_NEWARK: unknown
R1-R9 R11-R57 R_POW R_VCC R_VDD RB0_0 RB0_1 RB1_0 RB1_1 = rcl:R-EU_: RESISTOR, European symbol
R10 = pot:TRIM_EU-: POTENTIOMETER
ROTARY = pinhead:PINHD-2X3: PIN HEADER
S1 = switch:320-916: TOGGLE SWITCH distributor RS Components
SWD = pinhead-2:PINHD-1X06: PIN HEADER
T1 = transistor:*-NPN-: NPN Transistror BF959 corrected 2008.03.06
U$3 = dwm1000:MY_DWM1000_PAD_ONLY
USART3_FLASH = pinhead:PINHD-1X6: PIN HEADER
X2 = con-cypressindustries:MINI-USB_SHIELD5P4-: MINI USB-B R/A W/O POST 5 pol. Source: www.cypressindustries.com; OC_FARNELL: unknown; OC_NEWARK: unknown